# EAGLE design bullbridge_test (EAGLE 7.2.0)
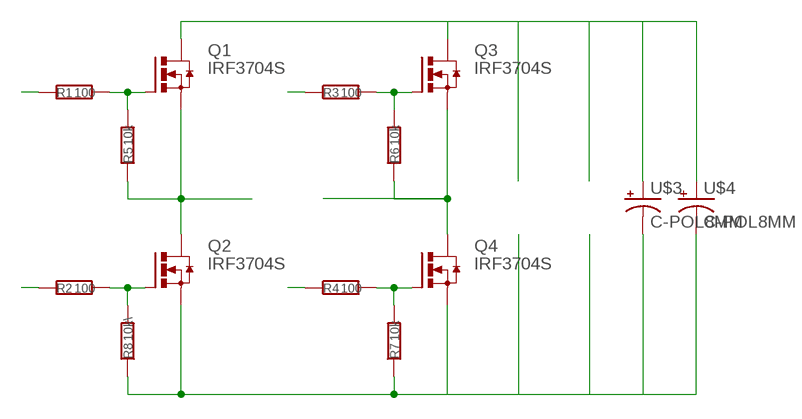
[diagram p0: schematic, sheet 1]

## Parts
Q1  IRF3704S  [D2PACK]
Q2  IRF3704S  [D2PACK]
Q3  IRF3704S  [D2PACK]
Q4  IRF3704S  [D2PACK]
R1  100  R0805  [R0805]
R2  100  R0805  [R0805]
R3  100  R0805  [R0805]
R4  100  R0805  [R0805]
R5  10k  R0805  [R0805]
R6  10k  R0805  [R0805]
R7  10k  R0805  [R0805]
R8  10k\  R0805  [R0805]
U$3  C-POL8MM  [PCAP8]
U$4  C-POL8MM  [PCAP8]

## Nets
N$4: Q1.1(G) R1.2 R5.2
N$5: Q3.1(G) R3.2 R6.2
N$6: Q4.1(G) R4.2 R7.2
N$7: Q1.3(S) Q2.2(D) R5.1
N$10: Q3.3(S) Q4.2(D) R6.1
N$15: Q1.2(D) Q3.2(D) U$3.P$1(+) U$4.P$1(+)
N$17: Q2.1(G) R2.2 R8.2
N$18: R3.1
N$19: R1.1
N$20: R2.1
N$21: R4.1
N$26: Q2.3(S) Q4.3(S) R7.1 R8.1 U$3.P$2(-) U$4.P$2(-)

## Library data of the parts
Q1-Q4 = transistor-power:IRF3704: SMPS MOSFET HEXFET® Power MOSFET Source: http://www.irf.com/product-info/datasheets/data/irf3704.pdf
R1-R8 = CasaLibrary:R
U$3 U$4 = CasaLibrary:C-POL

## Board
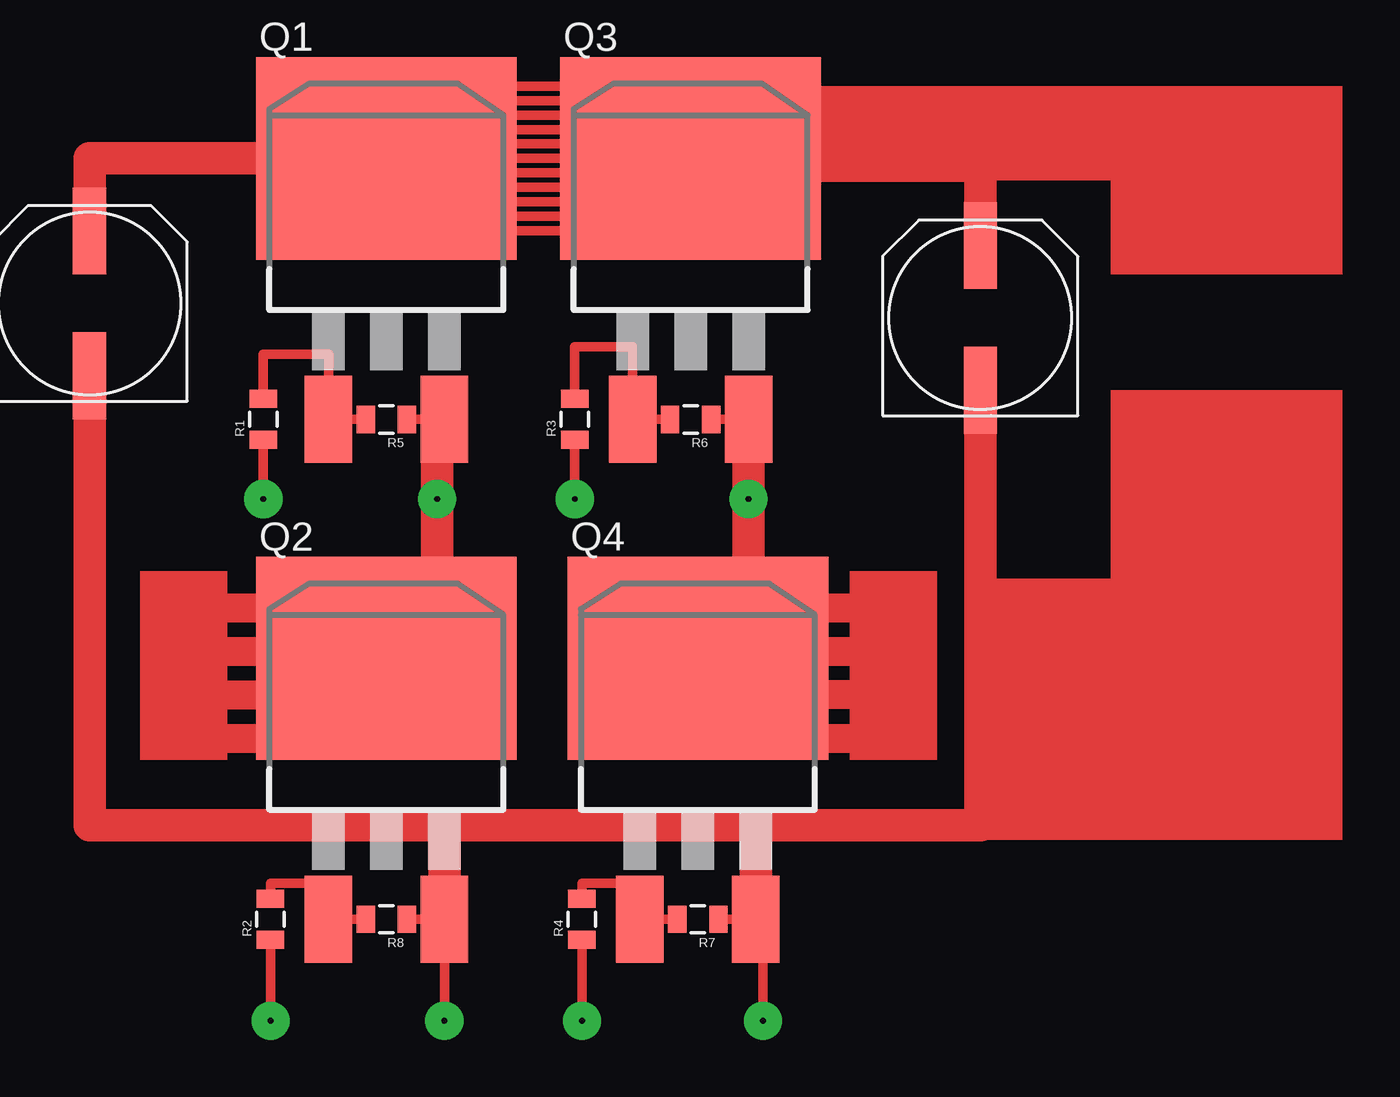
[diagram p1: board, top side]

No outline drawn. Coordinates in mm, seen from the top.
Copper layers (1*16): Top 0.035mm / dielectric 1.5mm / Bottom 0.035mm
Design rules "default": minimum track width 0.2mm, minimum drill 0.2mm, track to track 0.2mm, track to pad 0.2mm, pad to pad 0.2mm, via to via 0.2mm, smd to smd 0.2mm, copper to edge 0.2mm, drill to drill 0.2mm, minimum pad ring 10mil, minimum via ring 8mil, stop-mask expansion 4mil, vias tented up to drill 0mil, thermal gap 10mil
tRestrict: area 14.3,-10.5 to 18.4,-10.2; area 16.2,13 to 21,13.3; area 18.4,10.5 to 18.7,15.2

### Footprints (pad centres in the part's own frame; a part is rotated, then mirrored left to right if it is on the bottom)
D2PACK = smd 2.083 x 3.81: 1 -2.54,-8.89; 3 2.54,-8.89 | smd 11.43 x 8.89: 2 0,2.54
R0805 = smd 0.8 x 1.2: 1 -0.9,0; 2 0.9,0
PCAP8 = smd 3.8 x 1.46: P$1 -3.175,0; P$2 3.175,0

### Placement (x,y rotation side)
Q1  -18.73,11.11 0 top
Q2  -18.73,-10.79 0 top
Q3  -5.4,11.11 0 top
Q4  -5.08,-10.79 0 top
R1  -24.13,2.22 90 top
R2  -23.81,-19.68 90 top
R3  -10.48,2.22 90 top
R4  -10.16,-19.68 90 top
R5  -18.73,2.22 180 top
R6  -5.4,2.22 180 top
R7  -5.08,-19.68 180 top
R8  -18.73,-19.68 180 top
U$3  -31.75,7.3 270 top
U$4  7.3,6.67 270 top

### Tracks (layer width: path | path; a pad name or v marks a point on that pad's centre or on a via)
N$1
  Top 0.406: -18.41,14.92 -6.35,14.92 -6.35,14.61
N$2
  Top 0.406: -18.73,12.38 -6.35,12.38
N$3
  Top 0.406: -18.73,11.75 -6.67,11.75 -6.67,11.11
N$4
  Top 0.406: R5.2 Q1.1 -21.27,5.08 -24.13,5.08 R1.2
N$5
  Top 0.406: R3.2 -10.48,5.4 -7.94,5.4 Q3.1 R6.2
N$6
  Top 0.406: R4.2 -10.16,-18.1 -7.94,-18.1 -7.94,-19.68 Q4.1 R7.2
N$7  (via drill 0.25 pad 1.68)
  Top 0.406: R5.1 -16.51,2.22
  Top 1.27: -27.62,-7.94 -18.1,-7.94
  Top 1.422: Q1.3 -16.51,2.22 v-16.51,-1.27 -16.51,-7.94 -18.1,-7.94 -18.73,-7.94 Q2.2
N$8
  Top 0.406: -18.1,10.48 -5.4,10.48 -5.71,10.79
N$9
  Top 0.406: -16.51,15.56 -7.3,15.56
N$10  (via drill 0.25 pad 1.68)
  Top 0.406: R6.1 Q3.3
  Top 1.422: Q3.3 v-2.86,-1.27 -2.86,-8.57 -5.08,-8.57 Q4.2
N$11
  Top 0.406: -15.88,16.83 -7.3,16.83 -7.3,16.51
N$12
  Top 0.406: -15.88,13.02 -8.26,13.02 -8.26,12.7
N$13
  Top 0.406: -14.92,14.29 -8.57,14.29 -8.57,13.97
N$14
  Top 0.406: -15.24,11.11 -8.57,11.11
N$15
  Top 0.406: Q1.2 Q3.2
  Top 1.422: U$4.P$1 7.3,13.34 -5.4,13.34 Q3.2 | Q1.2 -31.75,13.65 U$3.P$1
N$16
  Top 1.27: -26.67,-6.03 -18.41,-6.03 -18.41,-5.4
N$17
  Top 0.406: R2.2 -23.81,-18.1 -21.27,-18.1 Q2.1 R8.2
N$22
  Top 0.406: -13.65,16.19 -9.84,16.19
N$23  (via drill 0.25 pad 1.68)
  Top 0.406: -24.13,1.27 v-24.13,-1.27
N$24  (via drill 0.25 pad 1.68)
  Top 0.406: -10.79,1.27 -10.48,1.27 v-10.48,-1.27
N$25  (via drill 0.25 pad 1.68)
  Top 0.406: v-23.81,-24.13 -23.81,-20.64
N$26  (via drill 0.25 pad 1.68)
  Top 0.406: R8.1 Q2.3 v-16.19,-24.13 | Q4.3 R7.1
  Top 1.422: Q4.3 -2.54,-15.56 | -2.54,-15.56 -16.19,-15.56 | -16.19,-15.56 Q2.3 | -16.19,-15.56 -31.75,-15.56 U$3.P$2 | U$4.P$2 7.3,-15.56 -2.54,-15.56
N$27  (via drill 0.25 pad 1.68)
  other vias: -10.16,-24.13
N$28  (via drill 0.25 pad 1.68)
  Top 0.406: v-2.22,-24.13 -2.22,-20
N$29
  Top 0.406: -10.48,-24.13 -10.16,-24.13 -10.16,-20.64
N$30
  Top 1.27: -26.99,-9.84 -19.68,-9.84
N$31
  Top 1.27: -27.94,-11.75 -18.1,-11.75
N$32
  Top 1.27: -2.54,-11.75 4.76,-11.75
N$33
  Top 1.27: 4.76,-9.84 -4.13,-9.84
N$34
  Top 1.27: -3.49,-7.94 4.13,-7.94 4.13,-8.26
N$35
  Top 1.27: -1.91,-6.03 3.81,-6.03
(copper drawn outside any net)
  shapes: Top area x9